# EAGLE design ELEC327_V4 (EAGLE 9.6.2)
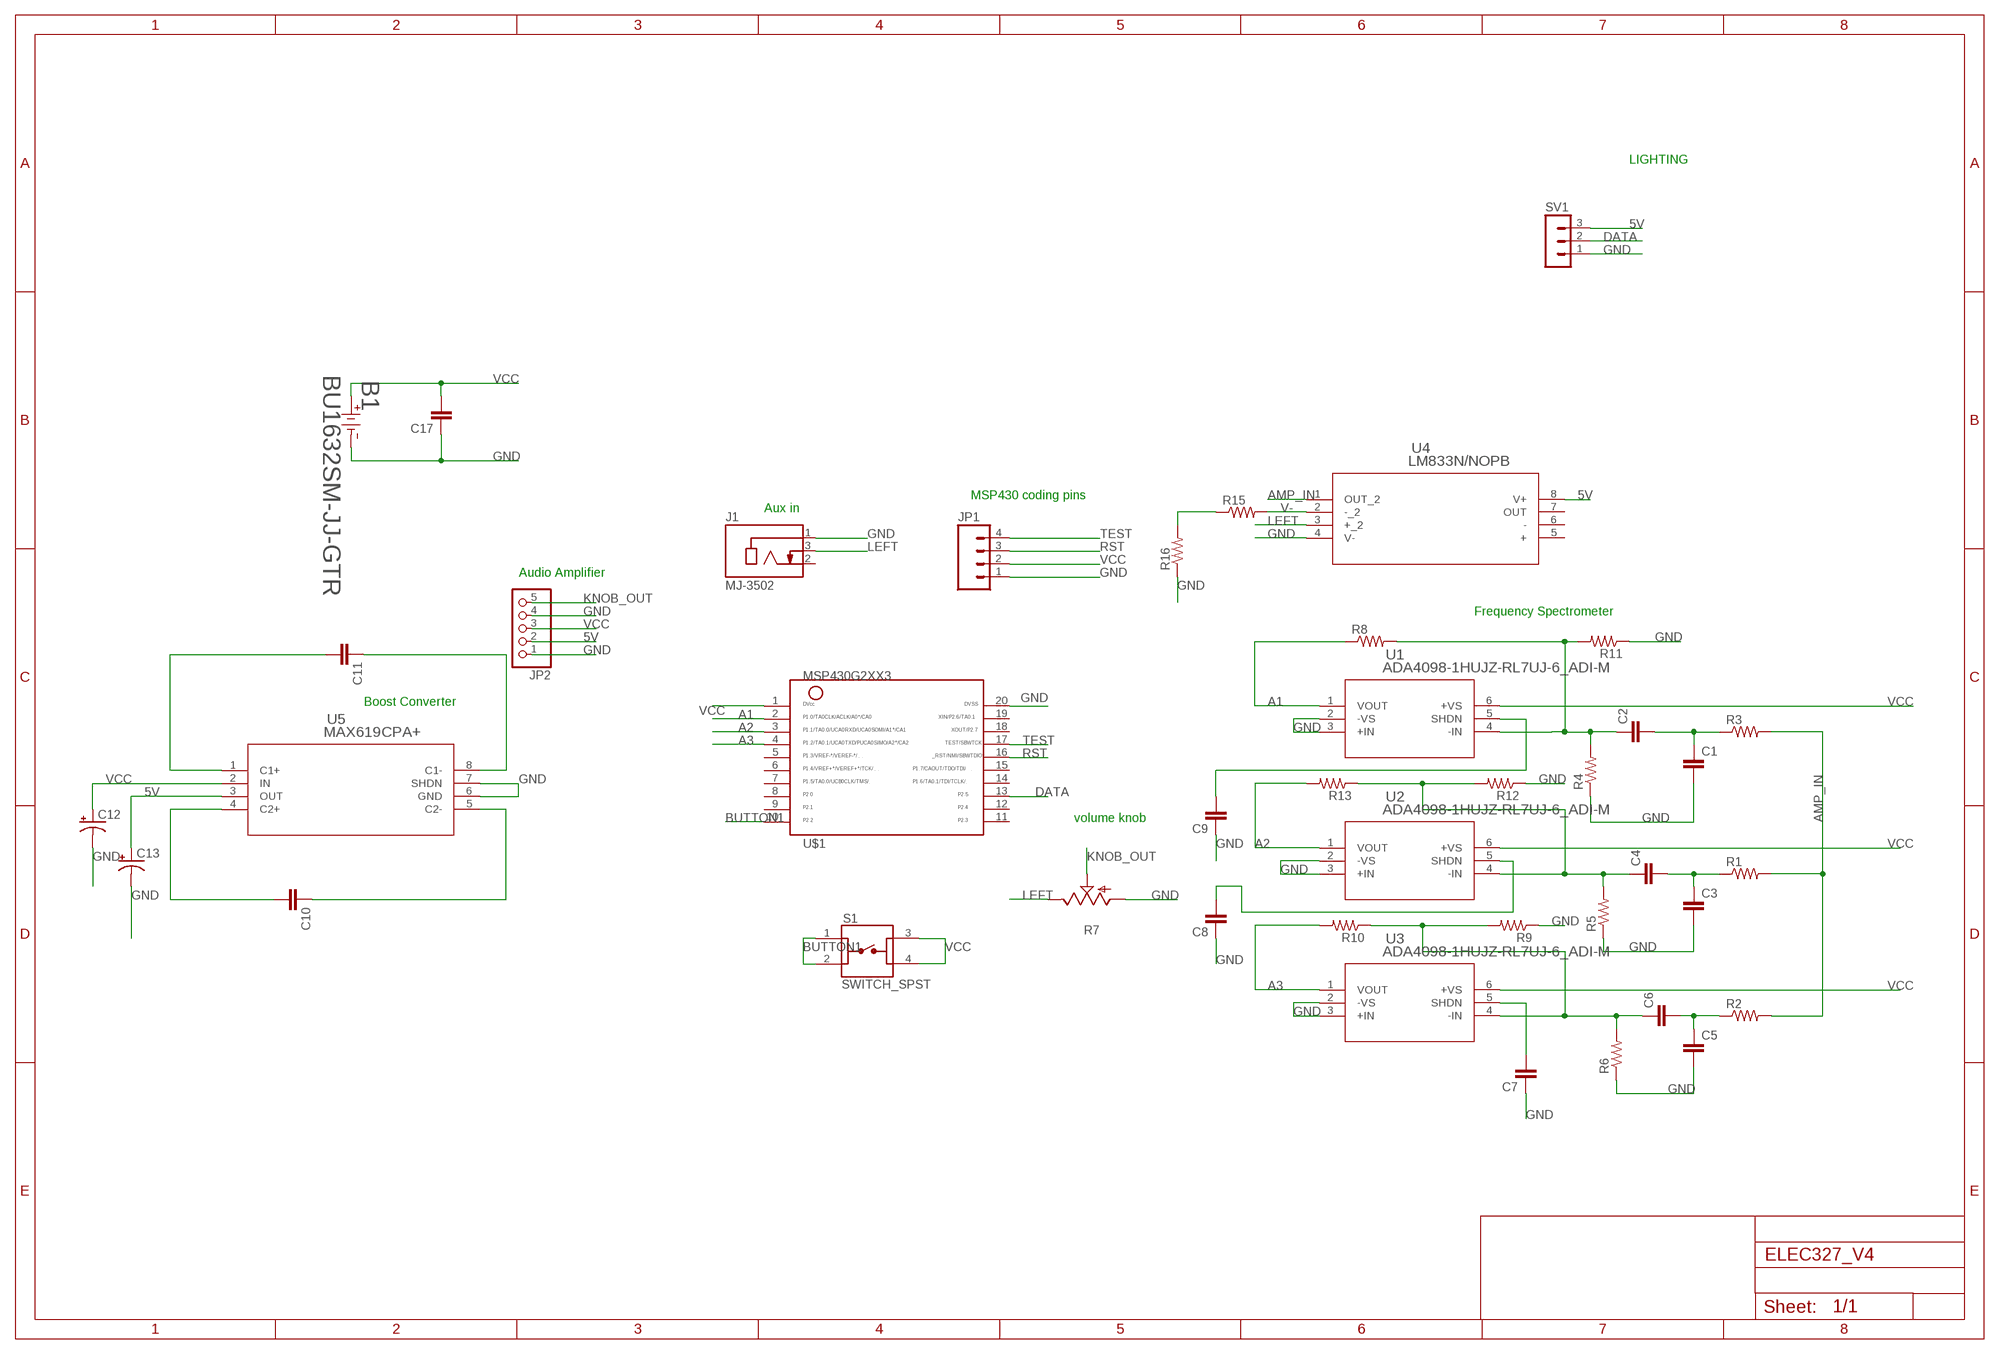
[diagram p0: schematic, sheet 1]

## Parts
B1  BU1632SM-JJ-GTR  [BU1632SM-JJ-GTR_MPD]
C1  C-EUC1206  [C1206]
C2  C-EUC1206  [C1206]
C3  C-EUC1206  [C1206]
C4  C-EUC1206  [C1206]
C5  C-EUC1206  [C1206]
C6  C-EUC1206  [C1206]
C7  C-EUC1206  [C1206]
C8  C-EUC1206  [C1206]
C9  C-EUC1206  [C1206]
C10  C-EUC1206  [C1206]
C11  C-EUC1206  [C1206]
C12  CPOL-USE5-6  [E5-6]
C13  CPOL-USE5-6  [E5-6]
C17  C-EUC1206  [C1206]
J1  MJ-3502  [CUI_MJ-3502]
JP1  HEADER_1X04LOCK  [1X04_LOCK]
JP2  PINHD-1X55X2MM  [1_05X2MM]
R1  R-US_R1206  [R1206]
R2  R-US_R1206  [R1206]
R3  R-US_R1206  [R1206]
R4  R-US_R1206  [R1206]
R5  R-US_R1206  [R1206]
R6  R-US_R1206  [R1206]
R7  TRIM_US-B25X  [B25X]
R8  R-US_R1206  [R1206]
R9  R-US_R1206  [R1206]
R10  R-US_R1206  [R1206]
R11  R-US_R1206  [R1206]
R12  R-US_R1206  [R1206]
R13  R-US_R1206  [R1206]
R15  R-US_R1206  [R1206]
R16  R-US_R1206  [R1206]
S1  SWITCH_SPST  [SW_1825910-7]
SV1  MA03-1  [MA03-1]
U1  ADA4098-1HUJZ-RL7UJ-6_ADI-M  [UJ-6_ADI-M]
U2  ADA4098-1HUJZ-RL7UJ-6_ADI-M  [UJ-6_ADI-M]
U3  ADA4098-1HUJZ-RL7UJ-6_ADI-M  [UJ-6_ADI-M]
U4  LM833N/NOPB  [N08E_TEX]
U5  MAX619CPA+  [21-0043D_8_MXM]
U$1  MSP430G2XX3TSSOP  [PW20]

## Nets
5V: C13.+ JP2.2 SV1.3 U4.8(V+) U5.3(OUT)
A1: R8.1 U1.1(VOUT) U$1.2
A2: R13.2 U2.1(VOUT) U$1.3
A3: R10.2 U3.1(VOUT) U$1.4
AMP_IN: R1.2 R2.2 R3.2 U4.1(OUT_2)
BUTTON1: S1.1 S1.2 U$1.10
DATA: SV1.2 U$1.13
GND: B1.2 C1.2 C3.2 C5.2 C7.1 C8.1 C9.1 C12.- C13.- C17.1 J1.1 JP1.1 JP2.1 JP2.4 R4.1 R5.1 R6.1 R7.A R9.1 R11.1 R12.1 R16.1 SV1.1 U1.2(-VS) U1.3(+IN) U2.2(-VS) U2.3(+IN) U3.2(-VS) U3.3(+IN) U4.4(V-) U5.6(GND) U5.7(SHDN) U$1.20
KNOB_OUT: JP2.5 R7.S
LEFT: J1.3 R7.E U4.3(+_2)
N$1: C2.1 R4.2 R8.2 R11.2 U1.4(-IN)
N$2: C1.1 C2.2 R3.1
N$3: C3.1 C4.2 R1.1
N$4: C5.1 C6.2 R2.1
N$5: C4.1 R5.2 R12.2 R13.1 U2.4(-IN)
N$6: C7.2 U3.5(SHDN)
N$7: C6.1 R6.2 R9.2 R10.1 U3.4(-IN)
N$8: C8.2 U2.5(SHDN)
N$9: C9.2 U1.5(SHDN)
N$10: C10.2 U5.4(C2+)
N$11: C10.1 U5.5(C2-)
N$12: C11.2 U5.1(C1+)
N$13: C11.1 U5.8(C1-)
N$14: R15.1 R16.2
RST: JP1.3 U$1.16
TEST: JP1.4 U$1.17
V-: R15.2 U4.2(-_2)
VCC: B1.1 C12.+ C17.2 JP1.2 JP2.3 S1.3 S1.4 U1.6(+VS) U2.6(+VS) U3.6(+VS) U5.2(IN) U$1.1
Unconnected: J1.2 U4.5(+) U4.6(-) U4.7(OUT) U$1.5 U$1.6 U$1.7 U$1.8 U$1.9 U$1.11 U$1.12 U$1.14 U$1.15 U$1.18 U$1.19

## Notes on the sheet
- LIGHTING
- MSP430 coding pins
- Aux in
- Audio Amplifier
- Frequency Spectrometer
- Boost Converter
- volume knob

## Library data of the parts
B1 = ELEC327:BU1632SM-JJ-GTR; COPYRIGHT: Copyright (C) 2023 Ultra Librarian. All rights reserved.; MANUFACTURER_PART_NUMBER: BU1632SM-JJ-GTR; MFR_NAME: Memory Protection Devices
C1-C11 C17 = rcl:C-EU: CAPACITOR, European symbol; SPICEPREFIX: C
C12 C13 = rcl:CPOL-US: POLARIZED CAPACITOR, American symbol; SPICEPREFIX: C
J1 = MJ-3502:MJ-3502: 3.5 mm, Mono, Right Angle, Through Hole, Threaded Bushing, Audio Jack Connector; MANUFACTURER: CUI INC; PART_REV: A; STANDARD: MANUFACTURER RECOMMENDATIONS
JP1 = ELEC327:HEADER_1X04: Header 4 Standard 4-pin 0.1" header. Use with straight break away headers (SKU : PRT-00116), right angle break away headers (PRT-00553), swiss pins (PRT-00743), machine pins (PRT-00117), and female headers (PRT-00115). Molex polarized connector foot print use with SKU : PRT-08231 with associated crimp pins and housings.
JP2 = pinhead:PINHD-1X5: PIN HEADER
R1-R6 R8-R13 R15 R16 = rcl:R-US_: RESISTOR, American symbol; SPICEPREFIX: R
R7 = pot:TRIM_US-: POTENTIOMETER
S1 = ELEC327:SWITCH_SPST: TE Connectivity Alcoswitch, 6mm Switch Tactile OFF (ON) SPST Round Button PC Pins 0.05A 24VDC 100000Cycles 2.55N Thru-Hole Loose Through Hole Version 1825910-7 <https://www.digikey.com/en/products/detail/te-connectivity-alcoswitch-switches/1825910-7/1731414> Surface Mount Version 1571563-4 <https://www.digikey.com/en/products/detail/te-connectivity-alcoswitch-switches/1571563-4/2400231>; COMMENT: 1825910-7; CONFIGURATION_POLE-THROW: Single Pole - Single Throw; CONTACT_CURRENT_RATING: 50 mA; DESCRIPTION: Switch Tactile OFF (ON) SPST Round Button PC Pins 0.05A 24VDC 100000Cycle 2.55N Thru-Hole Loose Piece; DIGI-KEY_PART_NUMBER: 450-1804-ND; EU_ROHS_COMPLIANCE: Compliant; MF: TE Connectivity; MP: 1825910-7; PACKAGE: None; PURCHASE-URL: https://pricing.snapeda.com/search/part/1825910-7/?ref=eda
SV1 = con-lstb:MA03-1: PIN HEADER; OC_FARNELL: unknown; OC_NEWARK: unknown
U1-U3 = ADA4098:ADA4098-1HUJZ-RL7; COPYRIGHT: Copyright (C) 2023 Ultra Librarian. All rights reserved.; MANUFACTURER_PART_NUMBER: ADA4098-1HUJZ-RL7; MFR_NAME: Analog Devices Inc
U4 = LM833N:LM833N/NOPB; COPYRIGHT: Copyright (C) 2023 Ultra Librarian. All rights reserved.; MANUFACTURER_PART_NUMBER: LM833N/NOPB; MFR_NAME: Texas Instruments
U5 = ul_MAX619CPA-:MAX619CPA+; COPYRIGHT: Copyright (C) 2023 Ultra Librarian. All rights reserved.; MANUFACTURER_PART_NUMBER: MAX619CPA+; MFR_NAME: Analog Devices Inc
U$1 = ELEC327:MSP430G2XX3: MSP430G2XX3 PDIP (N) 20 Pin Package

## Board
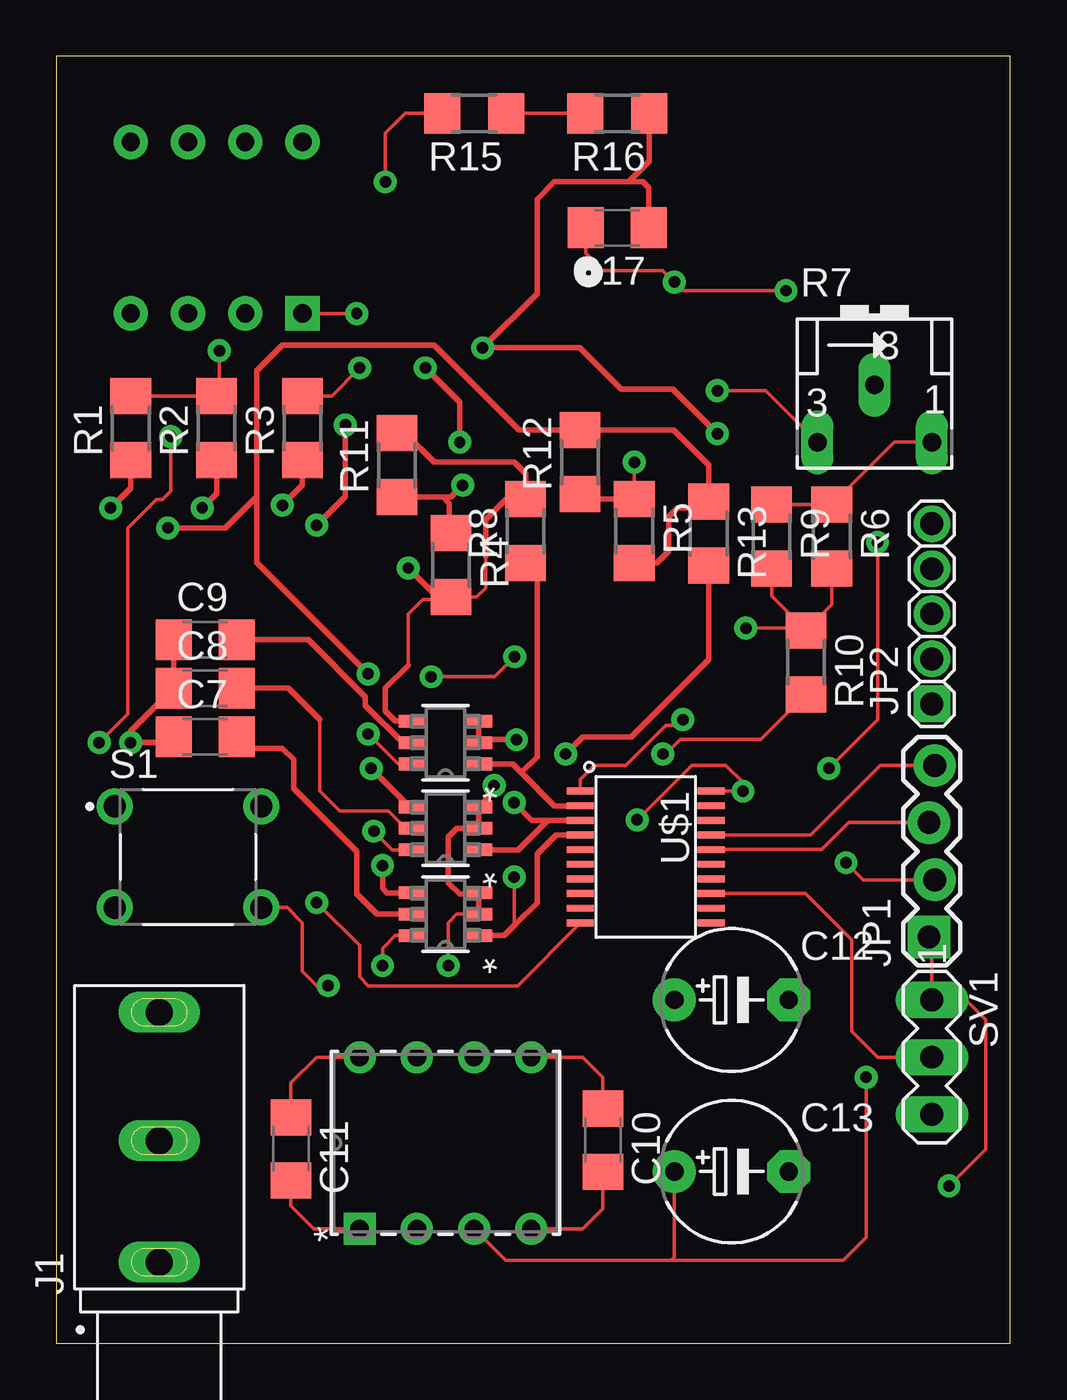
[diagram p1: board, top side]
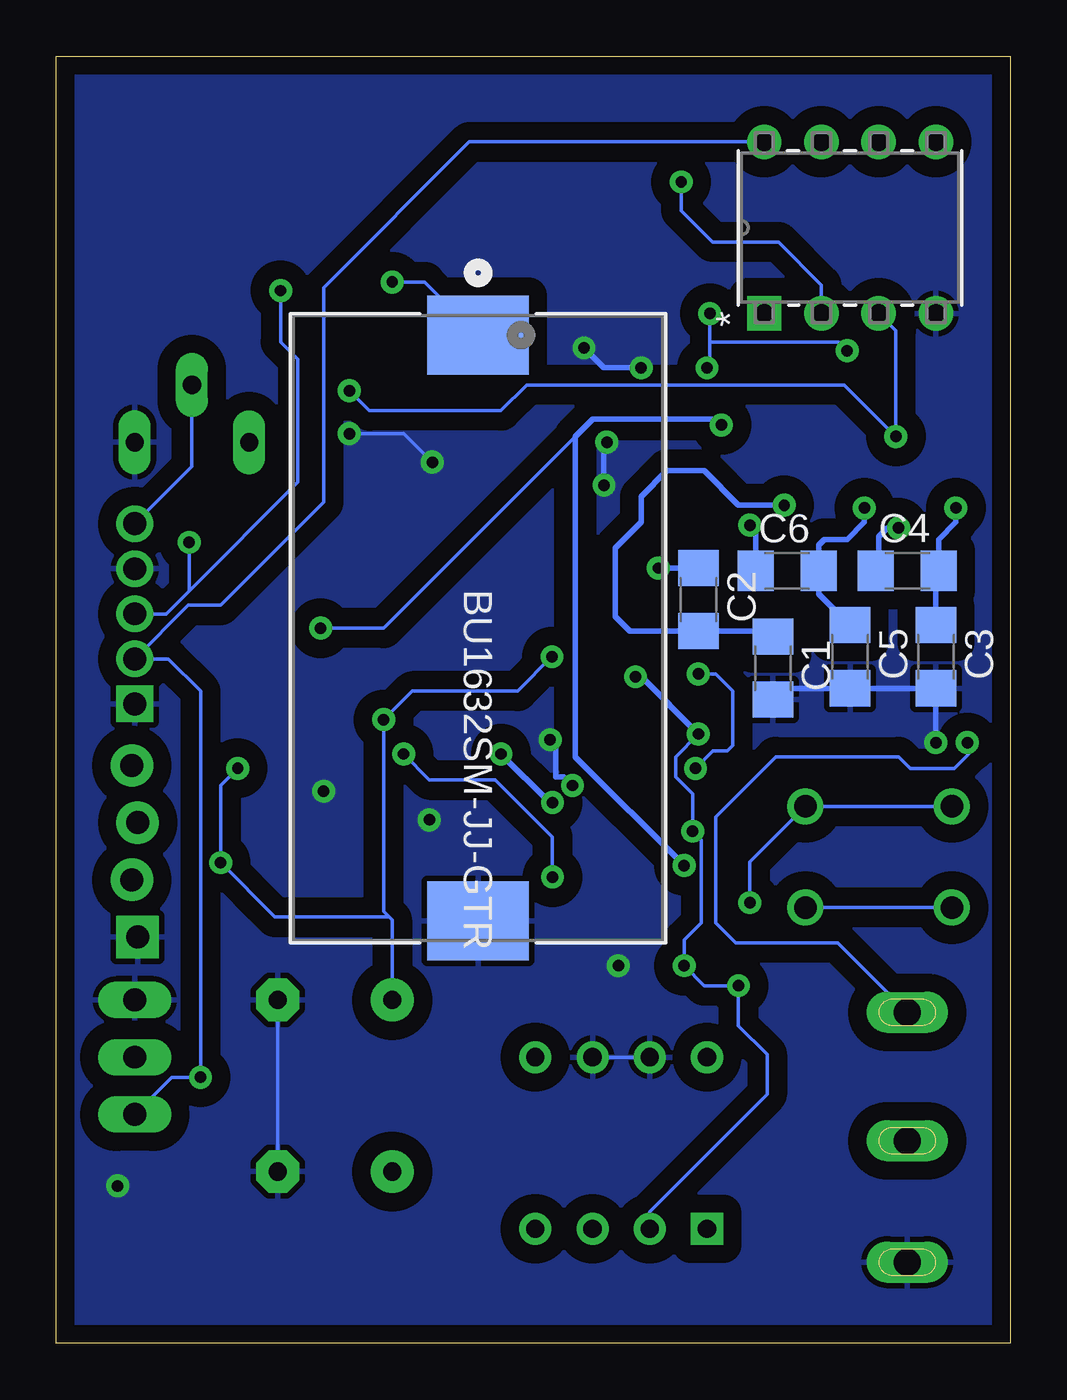
[diagram p2: board, bottom side, seen from below]

Size 42.34 x 57.14 mm. Coordinates in mm from the lower left corner, seen from the top.
Outline: 0,0 42.34,0 42.34,57.14 0,57.14 0,0
Copper layers (1*16): Top 0.035mm / dielectric 1.5mm / Bottom 0.035mm
Design rules "AdvancedCircuitsBarebones": minimum track width 6mil, minimum drill 20mil, track to track 6mil, track to pad 6mil, pad to pad 6mil, via to via 6mil, smd to smd 6mil, copper to edge 10mil, drill to drill 6mil, minimum pad ring 12mil, minimum via ring 10mil, stop-mask expansion 4mil, vias tented up to drill 25mil, thermal gap 10mil

### Footprints (pad centres in the part's own frame; a part is rotated, then mirrored left to right if it is on the bottom)
BU1632SM-JJ-GTR_MPD = smd 3.505 x 4.496: 1 -13,0; 2 13,0
C1206 = smd 1.6 x 1.8: 1 -1.4,0; 2 1.4,0
E5-6 = drill 0.813 pad 1.905: + -2.54,0 | drill 0.813 pad 1.905 octagon: - 2.54,0
CUI_MJ-3502 = drill 1.2 long: 1 -5.55,0; 2 -0.15,0; 3 5.55,0
1X04_LOCK = drill 1.016 pad 1.88 square: 1 0,0.127 | drill 1.016 pad 1.88: 2 2.54,-0.127; 3 5.08,0.127; 4 7.62,-0.127
1_05X2MM = drill 1.016 pad 1.3 square: 1 -4,0 | drill 1.016 pad 1.3: 2 -2,0; 3 0,0; 4 2,0; 5 4,0
R1206 = smd 1.6 x 1.803: 1 -1.422,0; 2 1.422,0
B25X = drill 0.813 long: A 2.54,-1.905; E -2.54,-1.905; S 0,0.635
SW_1825910-7 = drill 0.99: 1 -3.25,2.25; 2 3.25,2.25; 3 -3.25,-2.25; 4 3.25,-2.25
MA03-1 = drill 1.016 long: 1 -2.54,0; 2 0,0; 3 2.54,0
UJ-6_ADI-M = smd 1.206 x 0.559: 1 -1.48,0.95; 2 -1.48,0; 3 -1.48,-0.95; 4 1.48,-0.95; 5 1.48,0; 6 1.48,0.95
N08E_TEX = drill 0.813 pad 1.524 square: 1 0,0 | drill 0.813 pad 1.524: 2 0,-2.54; 3 0,-5.08; 4 0,-7.62; 5 7.62,-7.62; 6 7.62,-5.08; 7 7.62,-2.54; 8 7.62,0
21-0043D_8_MXM = drill 0.813 pad 1.321 square: 1 0,0 | drill 0.813 pad 1.321: 2 0,-2.54; 3 0,-5.08; 4 0,-7.62; 5 7.62,-7.62; 6 7.62,-5.08; 7 7.62,-2.54; 8 7.62,0
PW20 = smd 0.3 x 1.2: 1 -2.925,-2.9; 2 -2.275,-2.9; 3 -1.625,-2.9; 4 -0.975,-2.9; 5 -0.325,-2.9; 6 0.325,-2.9; 7 0.975,-2.9; 8 1.625,-2.9; 9 2.275,-2.9; 10 2.925,-2.9; 11 2.925,2.9; 12 2.275,2.9; 13 1.625,2.9; 14 0.975,2.9; 15 0.325,2.9; 16 -0.325,2.9; 17 -0.975,2.9; 18 -1.625,2.9; 19 -2.275,2.9; 20 -2.925,2.9

### Placement (x,y rotation side)
B1  23.62,31.75 270 bottom
C1  10.54,29.97 270 bottom
C2  13.84,33.02 270 bottom
C3  3.3,30.48 270 bottom
C4  4.57,34.29 0 bottom
C5  7.11,30.48 270 bottom
C6  9.91,34.29 0 bottom
C7  6.6,26.92 0 top
C8  6.6,29.08 0 top
C9  6.6,31.24 0 top
C10  24.26,9.02 270 top
C11  10.41,8.64 270 top
C12  29.97,15.24 0 top
C13  29.97,7.62 0 top
C17  24.89,49.53 180 top
J1  4.57,9.14 90 top
JP1  38.86,18.03 90 top
JP2  38.86,32.38 90 top
R1  3.3,40.64 90 top
R2  7.11,40.64 90 top
R3  10.92,40.64 90 top
R4  17.53,34.54 270 top
R5  25.65,36.07 270 top
R6  34.42,35.81 270 top
R7  36.32,41.91 0 top
R8  20.83,36.07 90 top
R9  31.75,35.81 270 top
R10  33.27,30.23 270 top
R11  15.11,38.99 90 top
R12  23.24,39.12 90 top
R13  28.96,35.94 270 top
R15  18.54,54.61 180 top
R16  24.89,54.61 180 top
S1  5.84,21.59 0 top
SV1  38.86,12.7 270 top
U1  17.27,26.67 180 top
U2  17.27,22.86 180 top
U3  17.27,19.05 180 top
U4  10.92,45.72 90 bottom
U5  13.46,5.08 90 top
U$1  26.16,21.59 270 top

### Tracks (layer width: path | path; a pad name or v marks a point on that pad's centre or on a via)
5V  (via drill 0.51)
  Top 0.152: U5.3 19.94,3.68 27.3,3.68 | 27.3,3.68 34.92,3.68 35.94,4.7 v35.94,11.81 | C13.+ 27.43,3.81 27.3,3.68
  Bottom 0.152: U4.8 24,53.34 30.48,46.86 30.48,37.34 35.05,32.77 36.48,32.77 JP2.2 37.37,30.39 35.94,28.96 v35.94,11.81 37.21,11.81 SV1.3
A1
  Top 0.254: U1.1 20.25,25.72 20.64,25.34 | U$1.2 22.11,23.86 20.64,25.34 | R8.1 21.34,34.14 21.34,26.04 20.64,25.34
A2  (via drill 0.51)
  Top 0.254: U2.1 20.51,21.91 21.82,23.21 | 21.82,23.21 U$1.3 | R13.2 28.96,30.35 25.53,26.92 23.37,26.92 v22.61,26.16 | v20.32,24 21.11,23.21 21.82,23.21
  Bottom 0.254: v22.61,26.16 20.45,24 v20.32,24
A3  (via drill 0.51)
  Top 0.152: R10.2 31.27,26.8 27.69,26.8 26.99,26.1 v26.92,26.16 | v20.32,20.7 20.32,18.67 20.38,18.61
  Top 0.254: U3.1 19.88,18.1 20.38,18.61 21.34,19.56 21.34,21.72 22.18,22.57 U$1.4
  Bottom 0.152: v26.92,26.16 25.78,25.02 22.86,25.02 20.32,22.48 v20.32,20.7
AMP_IN  (via drill 0.51)
  Top 0.152: v13.46,43.31 12.22,42.06 R3.2 | U4.1 v13.34,45.72 | v7.24,44.07 7.24,42.19 R2.2 R1.2
  Bottom 0.152: v13.34,45.72 13.34,44.45 | 13.34,44.45 13.34,43.43 v13.46,43.31 | 13.34,44.45 7.62,44.45 v7.24,44.07
BUTTON1  (via drill 0.51)
  Top 0.152: v11.56,19.56 13.46,17.65 13.46,16.26 13.84,15.88 20.47,15.88 U$1.10
  Bottom 0.152: S1.1 S1.2 11.56,21.38 v11.56,19.56
DATA
  Top 0.152: U$1.13 33.25,19.96 35.31,17.91 35.31,13.84 36.45,12.7 SV1.2
GND  (via drill 0.51)
  Top 0.152: C7.1 4.95,26.67 4.57,26.67 | 26.29,54.59 R16.1 26.31,53.49 | JP1.1 38.86,17.91 SV1.1 40.36,15.24 41.25,14.35 41.25,8.61 v39.62,6.99 | R9.1 R6.1 37.19,40.01 R7.A | U$1.20 v30.48,24.52 v30.48,24.51 30.48,24.89 29.72,25.65 28.19,25.65 v25.78,23.24 | U3.2 17.78,19.05 17.4,18.67 v17.4,16.76 | R5.1 v25.65,39.12
  Top 0.254: 4.57,26.67 v3.3,26.67 3.3,27.18 C8.1 C9.1 | U1.3 U1.2 18.88,26.8 v20.42,26.8 | U3.3 18.75,19.94 | 18.75,19.94 U3.2 | R4.1 17.45,36.04 17.45,37.29 17.17,37.57 | R12.1 23.45,37.49 R5.1 | R11.1 17.17,37.57 | 17.17,37.57 17.5,37.57 v18.03,38.1 | v17.91,40.01 17.91,41.78 v16.38,43.31 | v29.34,40.39 27.37,42.35 25.08,42.35 23.24,44.2 v18.92,44.2 21.34,46.61 21.34,50.8 22.1,51.56 25.4,51.56 | 25.4,51.56 26.04,51.56 26.29,51.3 C17.1 | 25.4,51.56 26.31,52.48 R16.1 | v19.43,24.77 19.43,24.49 U2.3 U2.2 17.78,22.86 17.4,22.48 17.4,20.45 17.91,19.94 18.75,19.94
  Bottom 0.152: 9.65,29.08 10.03,29.08 C1.2 | U5.7 U5.6 | C12.- C13.- | v25.65,39.12 26.92,40.39 v29.34,40.39
  Bottom 0.254: v3.3,26.67 C3.2 C5.2 9.65,29.08 | v18.03,38.1 18.03,39.62 17.91,39.75 v17.91,40.01 | v16.38,43.31 18.03,43.31 v18.92,44.2 | v20.42,26.8 20.17,26.54 20.17,25.15 19.81,25.15 v19.43,24.77
  pour Bottom (isolate 0.813): 0,0 42.42,0 42.42,4.7 42.42,57.15 40.01,57.15 0,57.15
KNOB_OUT
  Bottom 0.152: JP2.5 36.32,38.92 R7.S
LEFT  (via drill 0.51)
  Top 0.152: v1.9,26.67 3.17,27.94 3.17,36.2 4.45,37.47 4.7,37.47 5.08,37.85 v5.08,40.26 | v29.34,42.29 31.5,42.29 R7.E
  Bottom 0.152: J1.3 7.66,17.78 12.19,17.78 13.08,18.67 13.08,23.37 10.41,26.04 4.95,26.04 4.45,25.53 2.49,25.53 1.85,26.16 1.85,26.54 1.9,26.59 v1.9,26.67 | U4.3 5.08,44.96 v5.08,40.26 7.37,42.55 21.46,42.55 22.61,41.4 28.45,41.4 v29.34,42.29
N$1  (via drill 0.51)
  Top 0.152: 19.05,34.92 19.05,33.53 18.64,33.12 R4.2 17.42,33.02 17.02,33.02 16.26,33.02 15.62,32.38 15.62,30.1
  Top 0.254: 19.05,34.92 19.05,36.58 19.96,37.49 R8.2 20.83,38.61 20.32,39.12 16.76,39.12 15.47,40.41 R11.2 | 15.62,30.1 14.61,29.08 14.61,28.07 15.05,27.62 U1.4 | v15.62,34.42 17.02,33.02
  Bottom 0.254: C2.1 v15.62,34.42
N$2  (via drill 0.51)
  Top 0.254: R3.1 10.92,38.1 v10.03,37.21
  Bottom 0.152: 13.46,31.62 C2.2
  Bottom 0.254: C1.1 10.79,31.62 13.46,31.62 | C2.2 16.89,31.62 17.53,32.26 17.53,35.31 16.38,36.45 16.38,37.59 15.24,38.73 13.59,38.73 12.06,37.21 v10.03,37.21
N$3  (via drill 0.51)
  Top 0.254: R1.1 3.3,37.97 v2.41,37.08
  Bottom 0.254: C3.1 3.3,34.16 C4.2 3.17,35.69 2.41,36.45 v2.41,37.08
N$4  (via drill 0.51)
  Top 0.254: R2.1 7.11,37.72 v6.48,37.08
  Bottom 0.254: C5.1 8.51,33.27 C6.2 8.51,35.44 8.26,35.69 7.24,35.69 6.48,36.45 v6.48,37.08
N$5  (via drill 0.51)
  Top 0.254: v4.95,36.2 7.49,36.2 8.89,37.59 | 8.89,37.59 8.89,43.18 10.03,44.32 16.76,44.32 20.55,40.54 R12.2 27.41,40.54 28.96,38.99 R13.1 28.68,37.08 27.56,37.08 27.18,36.7 27.18,35.18 26.64,34.65 R5.2 | 8.89,37.59 8.89,34.67 v13.84,29.72 | v13.97,25.53 15.69,23.81 U2.4
  Bottom 0.152: v13.97,25.53 13.21,26.29 12.57,26.29 12.32,26.54 12.32,28.96 13.08,29.72 v13.84,29.72
  Bottom 0.254: C4.1 5.84,34.42 5.84,35.81 5.46,36.2 v4.95,36.2
N$6
  Top 0.254: C7.2 8.51,26.42 10.03,26.42 10.54,25.91 10.54,24.64 13.34,21.84 13.34,19.94 14.22,19.05 U3.5
N$7  (via drill 0.51)
  Top 0.152: R9.2 31.75,33.17 R10.1 | R6.2 34.42,32.79 R10.1 | v30.61,31.75 33.17,31.75 R10.1
  Top 0.254: v11.56,36.32 12.83,37.59 v12.83,40.77 | v14.48,21.21 14.48,20.19 14.67,20 U3.4
  Bottom 0.152: 19.3,40.26 27.81,31.75 v30.61,31.75
  Bottom 0.254: C6.1 11.31,36.07 v11.56,36.32 | v12.83,40.77 13.08,41.02 18.54,41.02 19.3,40.26 19.3,26.04 v14.48,21.21
N$8
  Top 0.152: 11.68,27.69 11.68,24.51 12.57,23.62 14.73,23.62 15.37,22.99
  Top 0.254: C8.2 10.29,29.08 11.68,27.69 | U2.5 15.49,22.86 15.37,22.99
N$9
  Top 0.152: 15.37,26.67 U1.5
  Top 0.254: C9.2 11.18,31.24 13.72,28.7 13.72,28.32 15.37,26.67
N$10
  Top 0.152: U5.4 23.37,5.08 24.26,5.97 C10.2
N$11
  Top 0.152: U5.5 23.37,12.7 24.26,11.81 C10.1
N$12
  Top 0.152: U5.1 11.43,5.08 10.41,6.1 C11.2
N$13
  Top 0.152: U5.8 11.56,12.7 10.41,11.56 C11.1
N$14
  Top 0.152: R15.1 R16.2
RST
  Top 0.152: U$1.16 33.98,21.91 35.18,23.11 JP1.3
TEST
  Top 0.152: U$1.17 33.49,22.57 36.58,25.65 JP1.4
V-  (via drill 0.51)
  Top 0.152: v14.61,51.56 14.61,53.72 15.49,54.61 R15.2
  Bottom 0.152: U4.2 8.38,46.99 10.29,48.9 13.21,48.9 14.61,50.29 v14.61,51.56
VCC  (via drill 0.51)
  Top 0.152: v32.38,46.74 27.81,46.74 v27.43,47.12 26.92,47.62 24.26,47.62 23.49,48.39 C17.2 | v36.45,35.56 36.45,27.69 v34.29,25.53 | v35.05,21.34 35.81,20.57 JP1.2 | S1.4 10.25,19.34 10.92,18.67 10.92,16.51 11.56,15.88 v12.06,15.88 | v14.48,16.76 14.48,17.53 15.05,18.1 U3.6 | v14.1,22.73 14.92,21.91 U2.6 | v13.84,27.05 15.17,25.72 U1.6 | v27.81,27.69 27.56,27.43 27.05,27.43 25.27,25.65 23.88,25.65 23.26,25.04 U$1.1 | v16.64,29.59 19.45,29.59 v20.34,30.48
  Bottom 0.152: S1.3 S1.4 | B1.1 25.99,47.12 v27.43,47.12 | v32.38,46.74 32.38,44.45 31.62,43.69 31.62,38.23 36.45,33.4 | JP2.3 37.47,32.38 36.45,33.4 | v34.29,25.53 35.05,24.77 v35.05,21.34 32.64,18.92 27.56,18.92 | 36.45,33.4 v36.45,35.56 | 27.56,18.92 27.43,18.8 C12.+ | v13.84,27.05 14.86,26.04 14.86,25.15 14.1,24.38 v14.1,22.73 13.72,22.35 13.72,18.67 14.48,17.91 v14.48,16.76 13.59,15.88 v12.06,15.88 12.06,14.1 10.79,12.83 10.79,11.05 16,5.84 U5.2 | 27.56,18.92 27.81,19.18 v27.81,27.69 26.54,28.96 21.87,28.96 v20.34,30.48
  Bottom 0.254: v13.84,27.05 16.38,29.59 v16.64,29.59